# EAGLE design riffle-CTD (EAGLE 6.5.0)
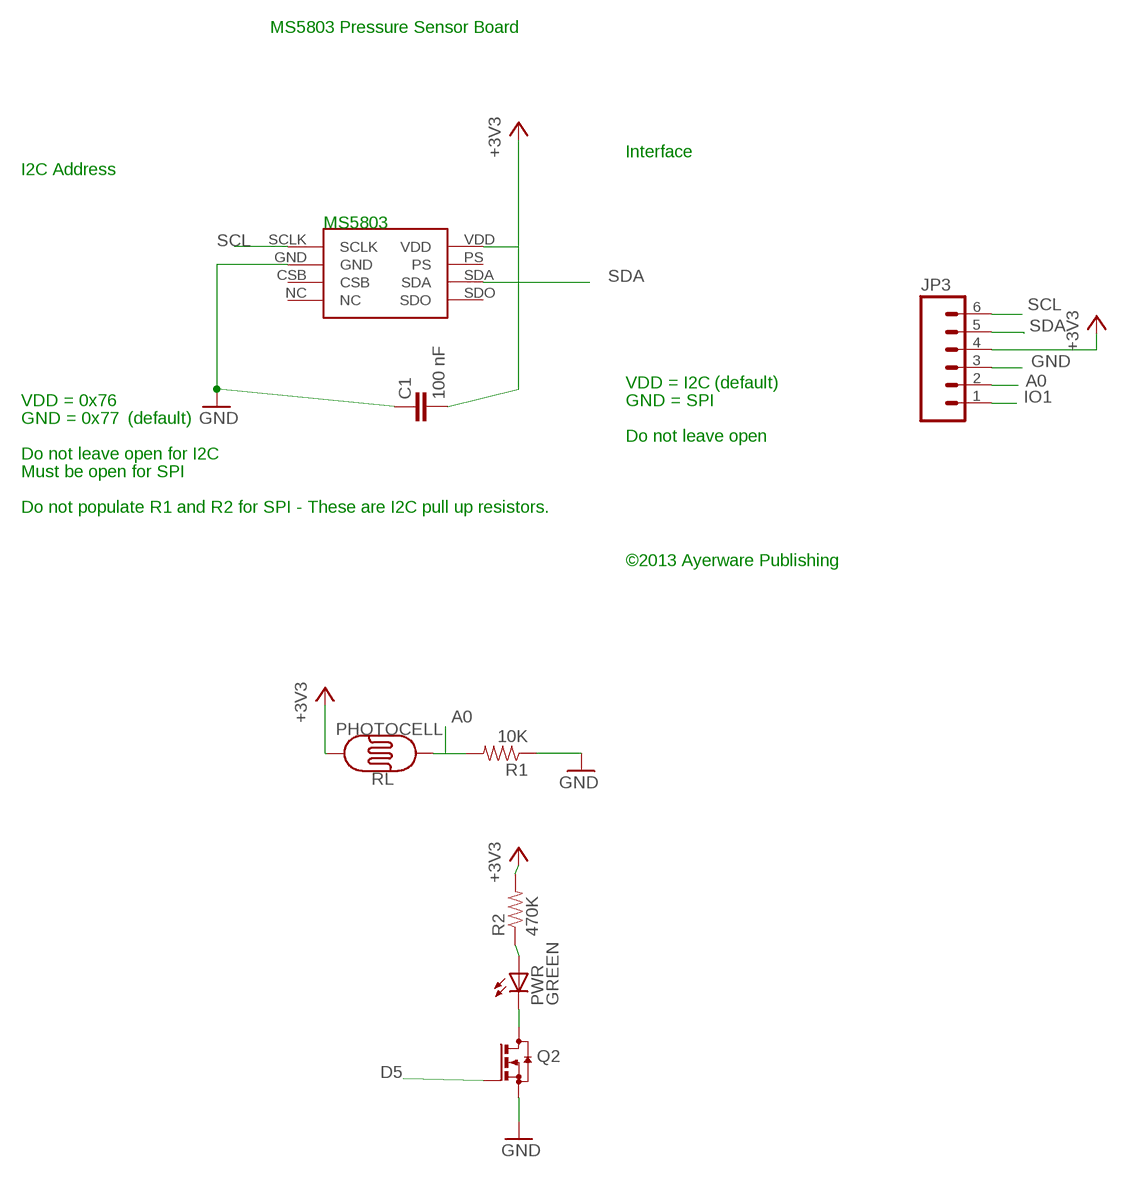
[diagram p0: schematic, sheet 1]

## Parts
C1  100 nF  CAP0402-CAP  [0402-CAP]
JP3  M06SIP  [1X06]
MS5803  MS5803-14BA  [MS5803-14BA]
PWR  GREEN  LEDCHIPLED_0805  [CHIPLED_0805]
Q2  BSS123  [SOT23]
R1  10K  RESISTOR0402-RES  [0402-RES]
R2  470K  RESISTOR0402-RES  [0402-RES]
RL  PHOTOCELL  PHOTOCELLPTH  [PHOTOCELL]

## Nets
+3V3: C1.1 JP3.4 MS5803.VDD R2.2 RL.2
A0: JP3.2 R1.2 RL.1
D5: Q2.1(G)
GND: C1.2 JP3.3 MS5803.GND Q2.2(S) R1.1
IO1: JP3.1
N$6: PWR.C Q2.3(D)
N$7: PWR.A R2.1
SCL: JP3.6 MS5803.SCLK
SDA: JP3.5 MS5803.SDA
Unconnected: MS5803.CSB MS5803.NC MS5803.PS MS5803.SDO

## Notes on the sheet
- MS5803 Pressure Sensor Board
- Interface
- I2C Address
- MS5803
- VDD = I2C | (default)
- VDD = 0x76 | GND = SPI
- GND = 0x77 | (default)
- Do not leave open
- Do not leave open for I2C
- Must be open for SPI
- Do not populate R1 and R2 for SPI - These are I2C pull up resistors.
- ©2013 Ayerware Publishing

## Library data of the parts
C1 = SparkFun:CAP: Capacitor Standard 0603 ceramic capacitor, and 0.1" leaded capacitor.
JP3 = SparkFun-Connectors:M06: Header 6 Standard 6-pin 0.1" header. Use with straight break away headers (SKU : PRT-00116), right angle break away headers (PRT-00553), swiss pins (PRT-00743), machine pins (PRT-00117), and female headers (PRT-00115). Molex polarized connector foot print use with SKU : PRT-08094 with associated crimp pins and housings. NOTES ON THE VARIANTS LOCK and LOCK_LONGPADS... This footprint was designed to help hold the alignment of a through-hole component (i.e. 6-pin header) while soldering it into place. You may notice that each hole has been shifted either up or down by 0.005 of an inch from it's more standard position (which is a perfectly straight line). This slight alteration caused the pins (the squares in the middle) to touch the edges of the holes. Because they are alternating, it causes a "brace" to hold the component in place. 0.005 has proven to be the perfect amount of "off-center" position when using our standard breakaway headers. Although looks a little odd when you look at the bare footprint, once you have a header in there, the alteration is very hard to notice. Also,if you push a header all the way into place, it is covered up entirely on the bottom side. This idea of altering the position of holes to aid alignment will be further integrated into the Sparkfun Library for other footprints. It can help hold any component with 3 or more connection pins.
MS5803 = Vic's Library:MS5803-14BA
PWR = adafruit:LED: LED OSRAM: - CHIPLED LG R971, LG N971, LY N971, LG Q971, LY Q971, LO R971, LY R971 LH N974, LH R974 LS Q976, LO Q976, LY Q976 LO Q996 - Hyper CHIPLED LW Q18S LB Q993, LB Q99A, LB R99A - SideLED LS A670, LO A670, LY A670, LG A670, LP A670 LB A673, LV A673, LT A673, LW A673 LH A674 LY A675 LS A676, LA A676, LO A676, LY A676, LW A676 LS A679, LY A679, LG A679 - Hyper Micro SIDELED® LS Y876, LA Y876, LO Y876, LY Y876 LT Y87S - SmartLED LW L88C, LW L88S LB L89C, LB L89S, LG L890 LS L89K, LO L89K, LY L89K LS L896, LA L896, LO L896, LY L896 - TOPLED LS T670, LO T670, LY T670, LG T670, LP T670 LSG T670, LSP T670, LSY T670, LOP T670, LYG T670 LG T671, LOG T671, LSG T671 LB T673, LV T673, LT T673, LW T673 LH T674 LS T676, LA T676, LO T676, LY T676, LB T676, LH T676, LSB T676, LW T676 LB T67C, LV T67C, LT T67C, LS T67K, LO T67K, LY T67K, LW E67C LS E67B, LA E67B, LO E67B, LY E67B, LB E67C, LV E67C, LT E67C LW T67C LS T679, LY T679, LG T679 LS T770, LO T770, LY T770, LG T770, LP T770 LB T773, LV T773, LT T773, LW T773 LH T774 LS E675, LA E675, LY E675, LS T675 LS T776, LA T776, LO T776, LY T776, LB T776 LHGB T686 LT T68C, LB T68C - Hyper Mini TOPLED® LB M676 - Mini TOPLED Santana® LG M470 LS M47K, LO M47K, LY M47K Source: http://www.osram.convergy.de/
Q2 = transistor-small-signal:BSS123: N-CHANNEL MOS FET
R1 R2 = SparkFun:RESISTOR: Resistor Basic schematic elements and footprints for 0603, 1206, and PTH resistors.
RL = SparkFunNew:PHOTOCELL: Photocell Also known as a CdS photoresistor. This is a low cost way to detect light levels. Resistance decreases with more incoming light. SparkFun SKU: SEN-09088

## Net classes
1 power: width 0.381 mm, clearance 0.254 mm

## Board
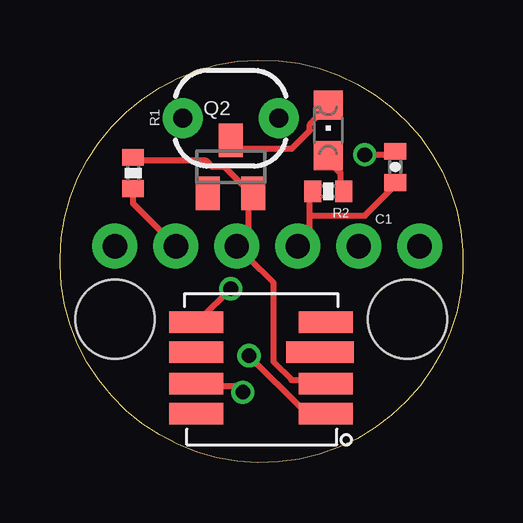
[diagram p1: board, top side]
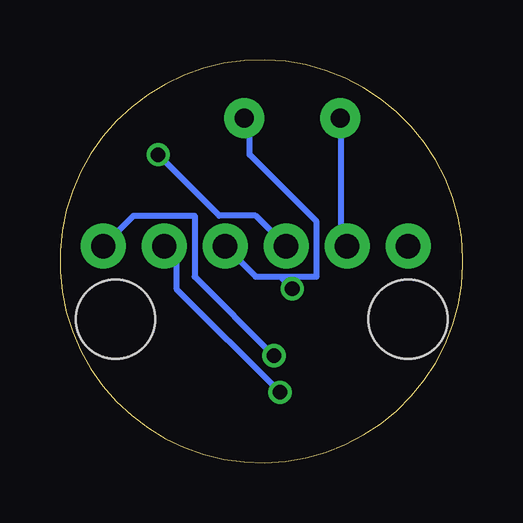
[diagram p2: board, bottom side, seen from below]

Size 16.79 x 16.8 mm. Coordinates in mm from the lower left corner, seen from the top.
Outline: 0,8.53 arc-358 0,8.27 0,8.53
Copper layers (1*16): Top 0.0356mm / dielectric 1.5011mm / Bottom 0.0356mm
Design rules "LaenPCBOrder": minimum track width 6mil, minimum drill 13mil, track to track 6mil, track to pad 6mil, pad to pad 6mil, via to via 6mil, smd to smd 6mil, copper to edge 15mil, drill to drill 6mil, minimum pad ring 7mil, minimum via ring 7mil, stop-mask expansion 3mil, vias tented up to drill 0mil, thermal gap 10mil
Holes 3.3 mm at 14.48,5.99 2.29,5.99

### Footprints (pad centres in the part's own frame; a part is rotated, then mirrored left to right if it is on the bottom)
0402-CAP = smd 0.7 x 0.9: 1 -0.65,0; 2 0.65,0
1X06 = drill 1.016 pad 1.88: 1 0,0; 2 2.54,0; 3 5.08,0; 4 7.62,0; 5 10.16,0; 6 12.7,0
MS5803-14BA = smd 2.8 x 0.9: CSB 2.45,0.65 | smd 2.25 x 0.9: GND 2.7,-0.65; NC 2.7,1.9; PS -2.7,0.65; SCLK 2.7,-1.9; SDA -2.7,-0.65; SDO -2.7,-1.9; VDD -2.7,1.9
CHIPLED_0805 = smd 1.2 x 1.2: A 0,-1.05; C 0,1.05
SOT23 = smd 1 x 1.4: 1 -0.95,-1.1; 2 0.95,-1.1; 3 0,1.1
0402-RES = smd 0.7 x 0.9: 1 -0.65,0; 2 0.65,0
PHOTOCELL = drill 0.8 pad 1.676: 1 -2,0; 2 2,0

### Placement (x,y rotation side)
C1  13.97,12.34 90 top
JP3  2.29,9.03 0 top
MS5803  8.38,3.95 0 top
PWR  11.18,13.86 0 top
Q2  7.11,12.34 0 top
R1  3.05,12.08 270 top
R2  11.18,11.32 180 top
RL  7.11,14.37 0 top

### Tracks (layer width: path | path; a pad name or v marks a point on that pad's centre or on a via)
+3V3  (via drill 0.61)
  Top 0.254: 10.41,10.3 10.41,9.54 JP3.4 | 10.41,10.3 10.41,11.32 R2.2 | 10.41,10.3 12.7,10.3 13.97,11.57 C1.1 | v7.11,7.26 5.84,5.99 MS5803.VDD
  Bottom 0.254: 7.62,7.76 v7.11,7.26 | 7.62,7.76 8.64,7.76 JP3.4 | 7.62,7.76 6.1,7.76 6.1,10.05 8.89,12.84 8.89,14.37 RL.2
A0
  Top 0.254: R1.2 3.05,10.81 JP3.2
  Bottom 0.254: JP3.2 5.08,9.03 5.08,14.37 RL.1
GND  (via drill 0.61)
  Top 0.254: R1.1 3.05,12.59 6.1,12.59 6.35,12.34 6.86,12.34 7.87,11.32 Q2.2 7.87,11.07 7.87,8.53 | v12.7,12.84 13.97,12.84 C1.2 | 7.87,8.53 8.89,7.51 8.89,4.21 9.65,3.45 10.92,3.45 MS5803.GND | 7.87,8.53 JP3.3
  Bottom 0.254: v12.7,12.84 10.16,10.3 8.64,10.3 JP3.3
N$6
  Top 0.254: PWR.C 11.18,14.88 10.41,14.11 10.41,13.86 9.65,13.1 7.37,13.1 7.11,13.35 Q2.3
N$7
  Top 0.254: R2.1 11.68,11.32 11.68,12.08 11.18,12.59 PWR.A
SCL  (via drill 0.61)
  Top 0.254: v7.87,4.46 10.16,2.18 10.92,2.18 MS5803.SCLK
  Bottom 0.254: v7.87,4.46 11.18,7.76 11.18,10.3 13.72,10.3 JP3.6
SDA  (via drill 0.61)
  Top 0.254: v7.62,2.94 7.37,3.19 5.84,3.19 MS5803.SDA
  Bottom 0.254: v7.62,2.94 11.94,7.26 11.94,9.03 JP3.5